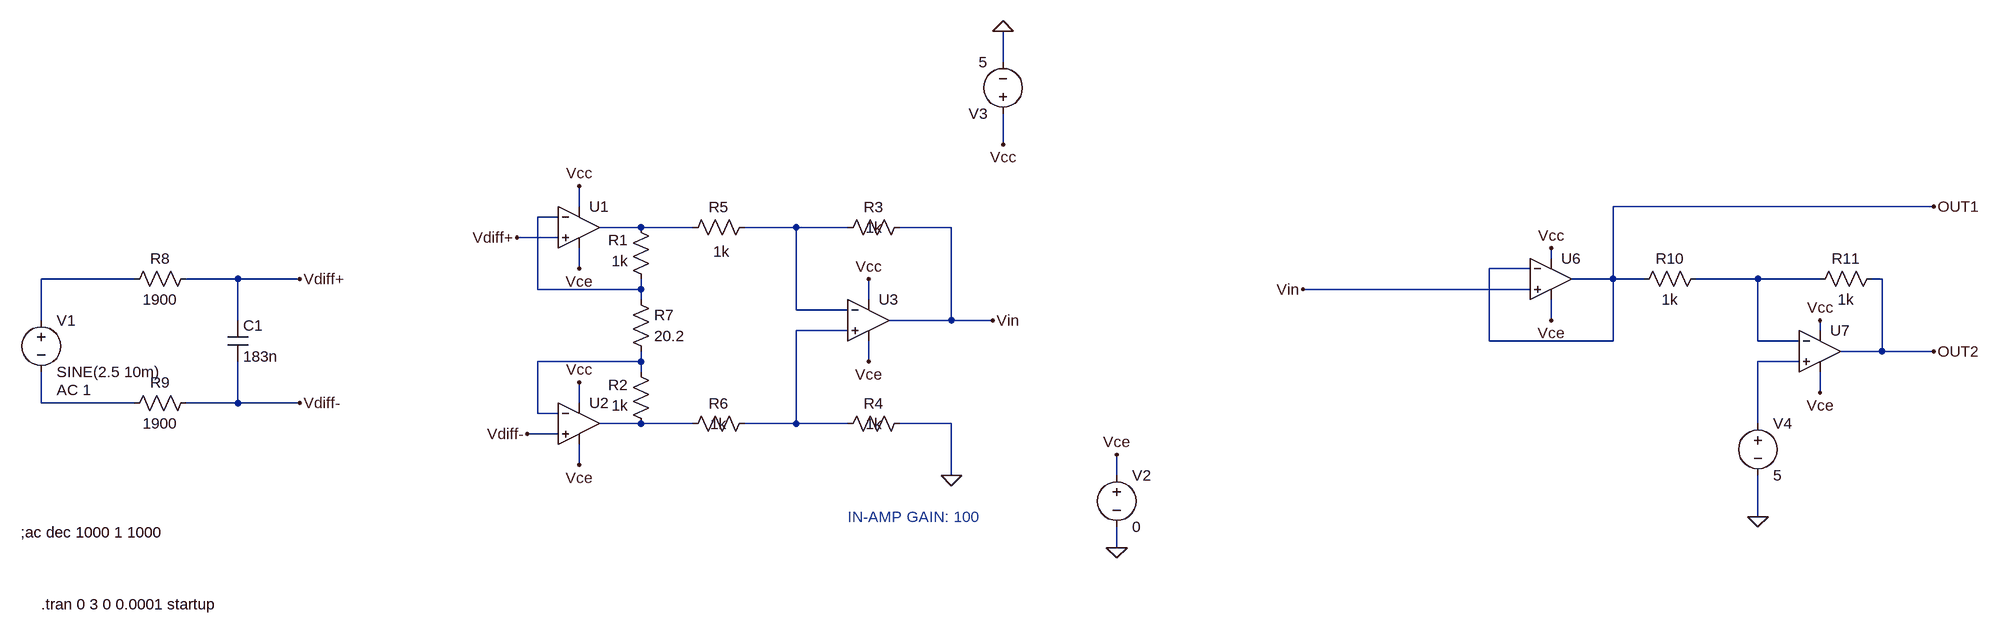
[diagram p0: schematic Diff-amp_2.asc]
Diff-amp_2.asc, the LTspice schematic file:
Version 4
SHEET 1 2632 680
WIRE 1072 -336 1072 -384
WIRE 1072 -208 1072 -256
WIRE 416 -112 416 -144
WIRE 2512 -112 2016 -112
WIRE 384 -96 352 -96
WIRE 512 -80 448 -80
WIRE 592 -80 512 -80
WIRE 752 -80 672 -80
WIRE 832 -80 752 -80
WIRE 992 -80 912 -80
WIRE 384 -64 320 -64
WIRE 1920 -32 1920 -48
WIRE 416 -16 416 -48
WIRE 1888 -16 1824 -16
WIRE -272 0 -416 0
WIRE -112 0 -192 0
WIRE -16 0 -112 0
WIRE 2016 0 2016 -112
WIRE 2016 0 1952 0
WIRE 2064 0 2016 0
WIRE 2240 0 2144 0
WIRE 2336 0 2240 0
WIRE 2432 0 2416 0
WIRE 352 16 352 -96
WIRE 512 16 512 0
WIRE 512 16 352 16
WIRE 1888 16 1536 16
WIRE 512 32 512 16
WIRE 864 32 864 0
WIRE 752 48 752 -80
WIRE 832 48 752 48
WIRE -416 64 -416 0
WIRE -112 64 -112 0
WIRE 992 64 992 -80
WIRE 992 64 896 64
WIRE 1056 64 992 64
WIRE 1920 64 1920 32
WIRE 832 80 752 80
WIRE 2336 80 2336 64
WIRE 1824 96 1824 -16
WIRE 2016 96 2016 0
WIRE 2016 96 1824 96
WIRE 2240 96 2240 0
WIRE 2304 96 2240 96
WIRE 2432 112 2432 0
WIRE 2432 112 2368 112
WIRE 2512 112 2432 112
WIRE 512 128 512 112
WIRE 512 128 352 128
WIRE 864 128 864 96
WIRE 2304 128 2240 128
WIRE 512 144 512 128
WIRE 2336 176 2336 144
WIRE -416 192 -416 144
WIRE -272 192 -416 192
WIRE -112 192 -112 128
WIRE -112 192 -192 192
WIRE -16 192 -112 192
WIRE 416 192 416 160
WIRE 352 208 352 128
WIRE 384 208 352 208
WIRE 512 224 448 224
WIRE 592 224 512 224
WIRE 752 224 752 80
WIRE 752 224 672 224
WIRE 832 224 752 224
WIRE 992 224 912 224
WIRE 2240 224 2240 128
WIRE 384 240 336 240
WIRE 416 288 416 256
WIRE 992 304 992 224
WIRE 1248 304 1248 272
WIRE 2240 368 2240 304
WIRE 1248 416 1248 384
FLAG 992 304 0
FLAG 336 240 Vdiff-
FLAG 416 160 Vcc
FLAG 864 0 Vcc
FLAG 416 288 Vce
FLAG 416 -16 Vce
FLAG 864 128 Vce
FLAG 416 -144 Vcc
FLAG 320 -64 Vdiff+
FLAG 1056 64 Vin
FLAG -16 0 Vdiff+
FLAG -16 192 Vdiff-
FLAG 1248 416 0
FLAG 1248 272 Vce
FLAG 1072 -384 0
FLAG 1072 -208 Vcc
FLAG 2240 368 0
FLAG 2512 -112 OUT1
FLAG 2512 112 OUT2
FLAG 2336 64 Vcc
FLAG 2336 176 Vce
FLAG 1920 -48 Vcc
FLAG 1920 64 Vce
FLAG 1536 16 Vin
SYMBOL res 528 16 R180
WINDOW 0 36 76 Left 2
WINDOW 3 36 44 Left 2
SYMATTR InstName R1
SYMATTR Value 1k
SYMBOL res 528 240 R180
WINDOW 0 36 76 Left 2
WINDOW 3 36 44 Left 2
SYMATTR InstName R2
SYMATTR Value 1k
SYMBOL res 928 -96 R90
WINDOW 0 0 56 VBottom 2
WINDOW 3 32 56 VBottom 2
SYMATTR InstName R3
SYMATTR Value 1k
SYMBOL res 928 208 R90
WINDOW 0 0 56 VBottom 2
WINDOW 3 32 56 VBottom 2
SYMATTR InstName R4
SYMATTR Value 1k
SYMBOL res 688 -96 R90
WINDOW 0 0 56 VBottom 2
WINDOW 3 69 52 VBottom 2
SYMATTR InstName R5
SYMATTR Value 1k
SYMBOL res 688 208 R90
WINDOW 0 0 56 VBottom 2
WINDOW 3 32 56 VBottom 2
SYMATTR InstName R6
SYMATTR Value 1k
SYMBOL res 496 16 R0
WINDOW 3 36 72 Left 2
SYMATTR Value 20.2
SYMATTR InstName R7
SYMBOL res -176 -16 R90
WINDOW 0 0 56 VBottom 2
WINDOW 3 32 56 VTop 2
SYMATTR InstName R8
SYMATTR Value 1900
SYMBOL cap -128 64 R0
SYMATTR InstName C1
SYMATTR Value 183n
SYMBOL res -176 176 R90
WINDOW 0 0 56 VBottom 2
WINDOW 3 32 56 VTop 2
SYMATTR InstName R9
SYMATTR Value 1900
SYMBOL voltage -416 48 R0
WINDOW 123 24 124 Left 2
WINDOW 39 0 0 Left 0
SYMATTR Value2 AC 1
SYMATTR InstName V1
SYMATTR Value SINE(2.5 10m)
SYMBOL voltage 1248 288 R0
WINDOW 123 0 0 Left 0
WINDOW 39 0 0 Left 0
SYMATTR InstName V2
SYMATTR Value 0
SYMBOL voltage 1072 -240 R180
WINDOW 123 0 0 Left 0
WINDOW 39 0 0 Left 0
SYMATTR InstName V3
SYMATTR Value 5
SYMBOL OpAmps\\UniversalOpAmp 416 -80 R0
SYMATTR InstName U1
SYMBOL OpAmps\\UniversalOpAmp 416 224 R0
SYMATTR InstName U2
SYMBOL OpAmps\\UniversalOpAmp 864 64 R0
SYMATTR InstName U3
SYMBOL OpAmps\\UniversalOpAmp 1920 0 R0
SYMATTR InstName U6
SYMBOL res 2160 -16 R90
WINDOW 0 0 56 VBottom 2
WINDOW 3 32 56 VTop 2
SYMATTR InstName R10
SYMATTR Value 1k
SYMBOL res 2432 -16 R90
WINDOW 0 0 56 VBottom 2
WINDOW 3 32 56 VTop 2
SYMATTR InstName R11
SYMATTR Value 1k
SYMBOL OpAmps\\UniversalOpAmp 2336 112 R0
SYMATTR InstName U7
SYMBOL voltage 2240 208 R0
WINDOW 123 0 0 Left 0
WINDOW 39 0 0 Left 0
SYMATTR InstName V4
SYMATTR Value 5
TEXT 832 368 Left 2 ;IN-AMP GAIN: 100
TEXT -448 392 Left 2 !;ac dec 1000 1 1000
TEXT -416 504 Left 2 !.tran 0 3 0 0.0001 startup

The netlist it stands for:
* Diff-amp_2.asc
R1 N001 N002 1k
R2 N010 N007 1k
R3 Vin N003 1k
R4 0 N006 1k
R5 N003 N002 1k
R6 N006 N010 1k
R7 N001 N007 20.2
R8 Vdiff+ N004 1900
C1 Vdiff+ Vdiff- 183n
R9 Vdiff- N009 1900
V1 N004 N009 SINE(2.5 10m) AC 1
V2 Vce 0 0
V3 Vcc 0 5
XU1 Vdiff+ N001 Vcc Vce N002 level1 Avol=1Meg GBW=10Meg Vos=0 En=0 Enk=0 In=0 Ink=0 Rin=500Meg  ; pins In+ In- V+ V- OUT
XU2 Vdiff- N007 Vcc Vce N010 level1 Avol=1Meg GBW=10Meg Vos=0 En=0 Enk=0 In=0 Ink=0 Rin=500Meg  ; pins In+ In- V+ V- OUT
XU3 N006 N003 Vcc Vce Vin level1 Avol=1Meg GBW=10Meg Vos=0 En=0 Enk=0 In=0 Ink=0 Rin=500Meg  ; pins In+ In- V+ V- OUT
XU6 Vin OUT1 Vcc Vce OUT1 level1 Avol=1Meg GBW=10Meg Vos=0 En=0 Enk=0 In=0 Ink=0 Rin=500Meg  ; pins In+ In- V+ V- OUT
R10 N005 OUT1 1k
R11 OUT2 N005 1k
XU7 N008 N005 Vcc Vce OUT2 level1 Avol=1Meg GBW=10Meg Vos=0 En=0 Enk=0 In=0 Ink=0 Rin=500Meg  ; pins In+ In- V+ V- OUT
V4 N008 0 5
* IN-AMP GAIN: 100
;ac dec 1000 1 1000
.tran 0 3 0 0.0001 startup
.lib UniversalOpAmp1.lib
.backanno
.end